# EAGLE schematic M0_Express_eh_shield (EAGLE 9.1.3)
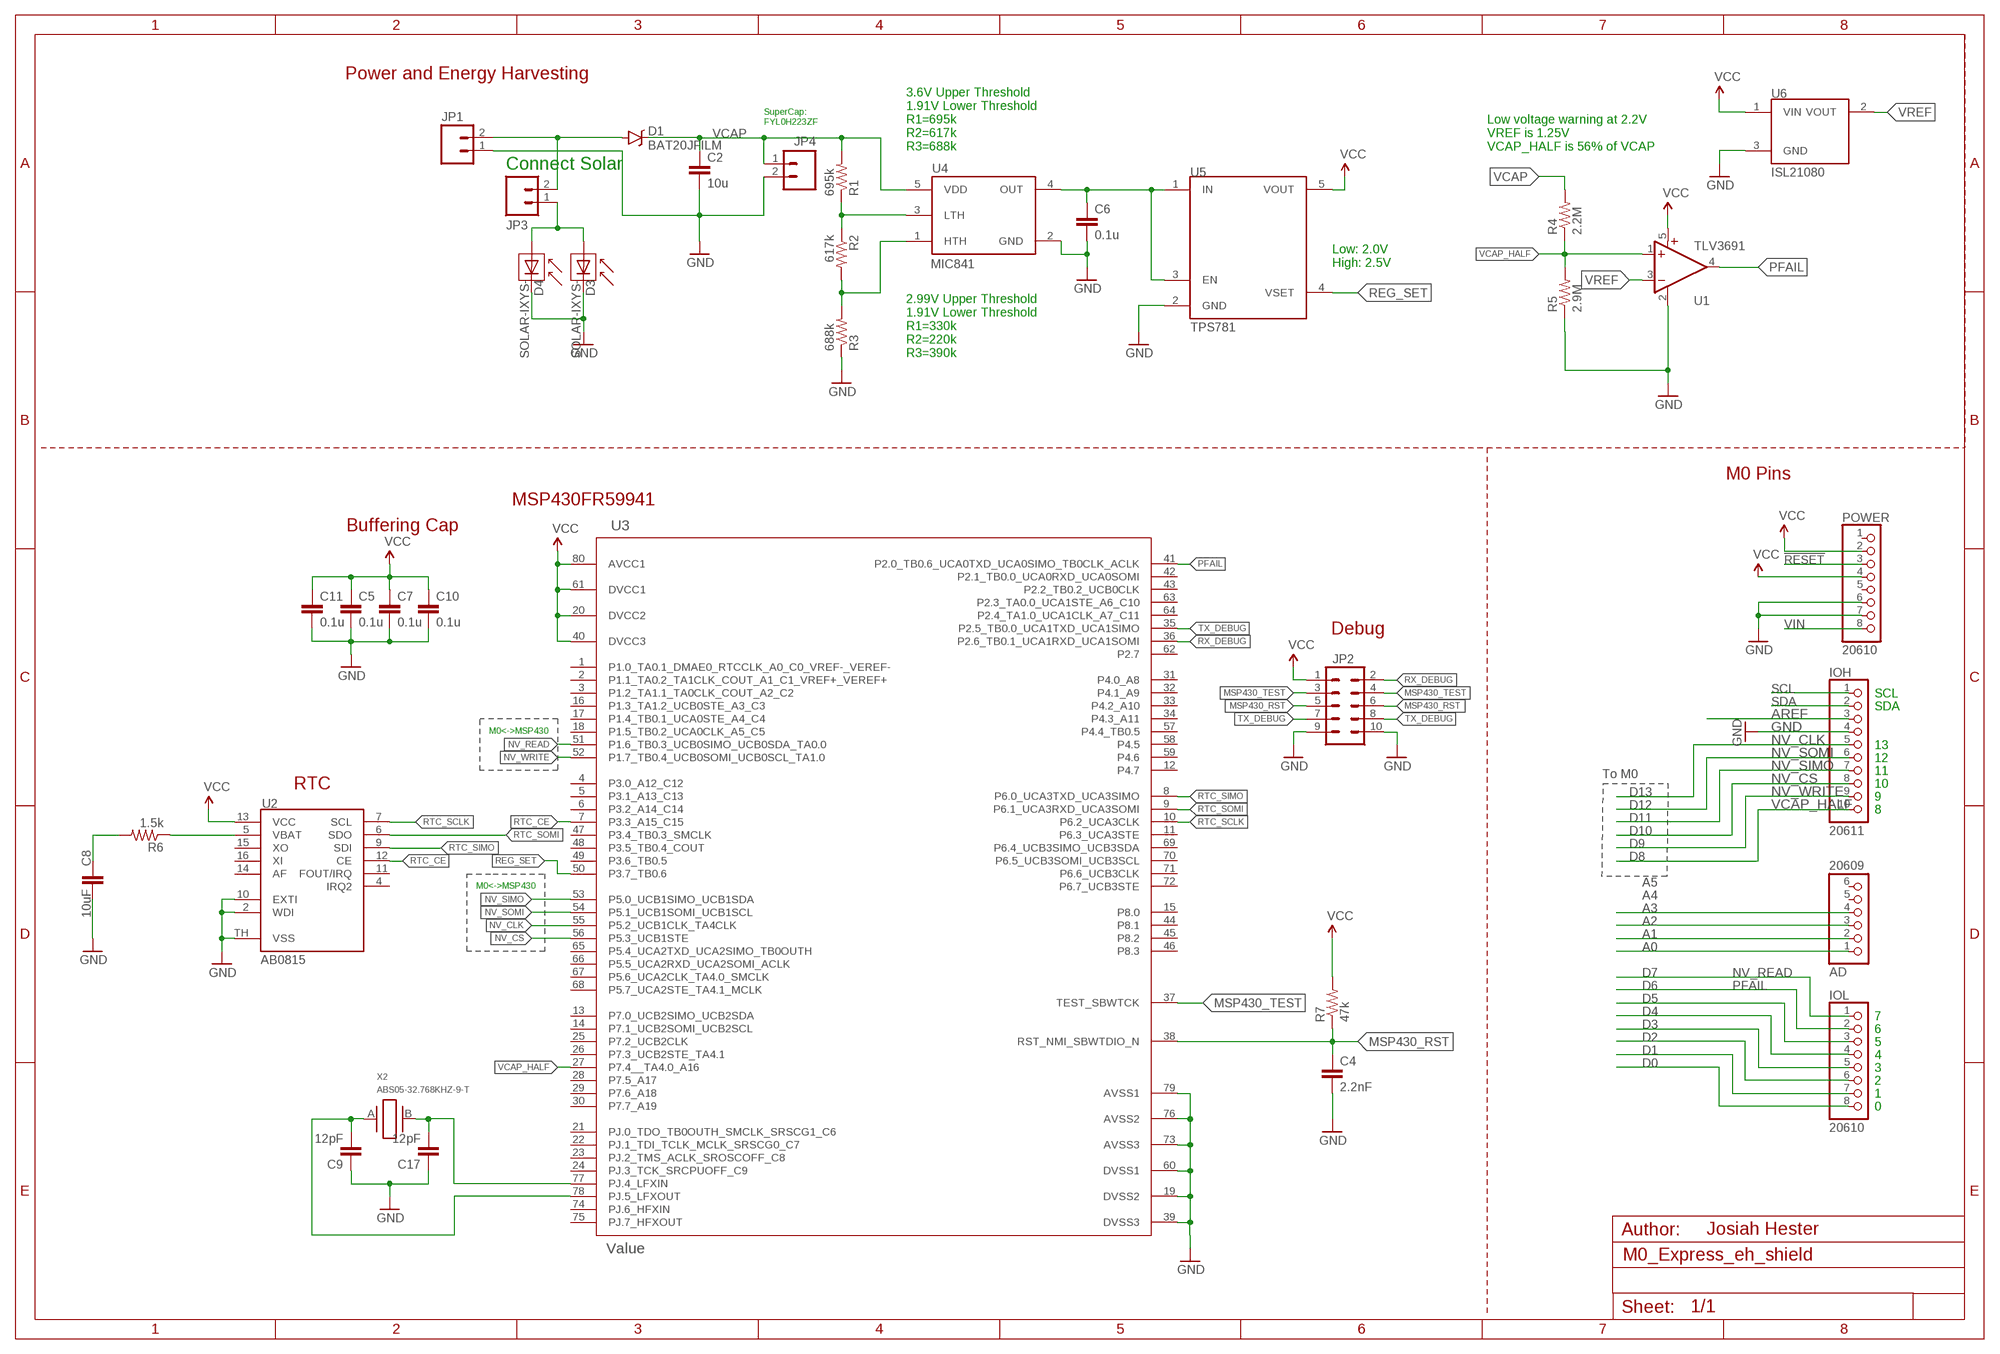
[diagram p0: schematic, sheet 1]

## Parts
AD  20609  HEADER-1X6OVALWAVE  [1X06_OVALWAVE]
C2  10u  CAP0805  [0805]
C4  2.2nF  C-EU0603  [0603]
C5  0.1u  C-EU0603  [0603]
C6  0.1u  C-EU0603  [0603]
C7  0.1u  C-EU0603  [0603]
C8  10uF  CAP0805  [0805]
C9  12pF  C-EU0603  [0603]
C10  0.1u  C-EU0603  [0603]
C11  0.1u  C-EU0603  [0603]
C17  12pF  C-EU0603  [0603]
D1  BAT20JFILM  [SOD-323]
D3  SOLAR-IXYS-  [SOLARBIT-12X1]
D4  SOLAR-IXYS-  [SOLARBIT-12X1]
IOH  20611  HEADER-1X10OVALWAVE  [1X10_OVALWAVE]
IOL  20610  HEADER-1X8OVALWAVE  [1X08_OVALWAVE]
JP1  M02LOCK  [1X02_LOCK]
JP2  M05X21.27MM  [2X5_1.27MM]
JP3  M02LOCK  [1X02_LOCK]
JP4  M025MM  [SCREWTERMINAL-5MM-2]
POWER  20610  HEADER-1X8OVALWAVE  [1X08_OVALWAVE]
R1  695k  R-EU0603  [0603]
R2  617k  R-EU0603  [0603]
R3  688k  R-EU0603  [0603]
R4  2.2M  R-EU0603  [0603]
R5  2.9M  R-EU0603  [0603]
R6  1.5k  R-EU0603  [0603]
R7  47k  R-EU0603  [0603]
U1  TLV3691  [SC70-5]
U2  AB0815  [QFN16]
U3  Value  MSP430FR5994IPNR  [PN0080A_N]
U4  MIC841  [SC70-5]
U5  TPS781  [DCK_R-PDSO-G5]
U6  ISL21080  [SOT-23]
X2  ABS05-32.768KHZ-9-T  [ABS05]

## Nets
!RESET: POWER.3
A0: AD.1
A1: AD.2
A2: AD.3
A3: AD.4
AREF [aref]: IOH.3
D0: IOL.8
D1: IOL.7
D2: IOL.6
D3: IOL.5
D4: IOL.4
D5: IOL.3
GND [gnd]: C2.2 C4.2 C5.2 C6.2 C7.2 C8.2 C9.1 C10.2 C11.2 C17.1 D3.-(C) D4.-(C) IOH.4 JP1.1 JP2.9 JP2.10 JP4.2 POWER.6 POWER.7 R3.1 R5.1 U1.2(GND) U2.2(WDI) U2.10(EXTI) U2.TH(VSS) U3.19(DVSS2) U3.39(DVSS3) U3.60(DVSS1) U3.73(AVSS3) U3.76(AVSS2) U3.79(AVSS1) U4.2(GND) U5.2(GND) U6.3(GND)
MSP430_RST: C4.1 JP2.5 JP2.6 R7.1 U3.38(RST_NMI_SBWTDIO_N)
MSP430_TEST: JP2.3 JP2.4 U3.37(TEST_SBWTCK)
N$1: D1.A JP1.2 JP3.2
N$2: R1.1 R2.1 U4.3(LTH)
N$3: R2.2 R3.2 U4.1(HTH)
N$4: R6.1 U2.5(VBAT)
N$5: C17.2 U3.77(PJ.4_LFXIN) X2.B
N$6: C9.2 U3.78(PJ.5_LFXOUT) X2.A
N$7: C6.1 U4.4(OUT) U5.1(IN) U5.3(EN)
N$8: C8.1 R6.2
N$10: D3.+(A) D4.+(A) JP3.1
NV_CLK: IOH.5 U3.55(P5.2_UCB1CLK_TA4CLK)
NV_CS: IOH.8 U3.56(P5.3_UCB1STE)
NV_READ: IOL.1 U3.51(P1.6_TB0.3_UCB0SIMO_UCB0SDA_TA0.0)
NV_SIMO: IOH.7 U3.53(P5.0_UCB1SIMO_UCB1SDA)
NV_SOMI: IOH.6 U3.54(P5.1_UCB1SOMI_UCB1SCL)
NV_WRITE: IOH.9 U3.52(P1.7_TB0.4_UCB0SOMI_UCB0SCL_TA1.0)
PFAIL: IOL.2 U1.4(OUT) U3.41(P2.0_TB0.6_UCA0TXD_UCA0SIMO_TB0CLK_ACLK)
REG_SET: U3.50(P3.7_TB0.6) U5.4(VSET)
RTC_CE: U2.12(CE) U3.7(P3.3_A15_C15)
RTC_SCLK: U2.7(SCL) U3.10(P6.2_UCA3CLK)
RTC_SIMO: U2.9(SDI) U3.8(P6.0_UCA3TXD_UCA3SIMO)
RTC_SOMI: U2.6(SDO) U3.9(P6.1_UCA3RXD_UCA3SOMI)
RX_DEBUG: JP2.2 U3.36(P2.6_TB0.1_UCA1RXD_UCA1SOMI)
SCL: IOH.1
SDA: IOH.2
TX_DEBUG: JP2.7 JP2.8 U3.35(P2.5_TB0.0_UCA1TXD_UCA1SIMO)
VCAP: C2.1 D1.C JP4.1 R1.2 R4.2 U4.5(VDD)
VCAP_HALF: IOH.10 R4.1 R5.2 U1.1(+IN) U3.27(P7.4__TA4.0_A16)
VCC: C5.1 C7.1 C10.1 C11.1 JP2.1 POWER.2 POWER.4 R7.2 U1.5(V+) U2.13(VCC) U3.20(DVCC2) U3.40(DVCC3) U3.61(DVCC1) U3.80(AVCC1) U5.5(VOUT) U6.1(VIN)
VIN [USB]: POWER.8
VREF: U1.3(-IN) U6.2(VOUT)
Unconnected: AD.5 AD.6 POWER.1 POWER.5 U2.4(IRQ2) U2.11(FOUT/IRQ) U2.14(AF) U2.15(XO) U2.16(XI) U3.1(P1.0_TA0.1_DMAE0_RTCCLK_A0_C0_VREF-_VEREF-) U3.2(P1.1_TA0.2_TA1CLK_COUT_A1_C1_VREF+_VEREF+) U3.3(P1.2_TA1.1_TA0CLK_COUT_A2_C2) U3.4(P3.0_A12_C12) U3.5(P3.1_A13_C13) U3.6(P3.2_A14_C14) U3.11(P6.3_UCA3STE) U3.12(P4.7) U3.13(P7.0_UCB2SIMO_UCB2SDA) U3.14(P7.1_UCB2SOMI_UCB2SCL) U3.15(P8.0) U3.16(P1.3_TA1.2_UCB0STE_A3_C3) U3.17(P1.4_TB0.1_UCA0STE_A4_C4) U3.18(P1.5_TB0.2_UCA0CLK_A5_C5) U3.21(PJ.0_TDO_TB0OUTH_SMCLK_SRSCG1_C6) U3.22(PJ.1_TDI_TCLK_MCLK_SRSCG0_C7) U3.23(PJ.2_TMS_ACLK_SROSCOFF_C8) U3.24(PJ.3_TCK_SRCPUOFF_C9) U3.25(P7.2_UCB2CLK) U3.26(P7.3_UCB2STE_TA4.1) U3.28(P7.5_A17) U3.29(P7.6_A18) U3.30(P7.7_A19) U3.31(P4.0_A8) U3.32(P4.1_A9) U3.33(P4.2_A10) U3.34(P4.3_A11) U3.42(P2.1_TB0.0_UCA0RXD_UCA0SOMI) U3.43(P2.2_TB0.2_UCB0CLK) U3.44(P8.1) U3.45(P8.2) U3.46(P8.3) U3.47(P3.4_TB0.3_SMCLK) U3.48(P3.5_TB0.4_COUT) U3.49(P3.6_TB0.5) U3.57(P4.4_TB0.5) U3.58(P4.5) U3.59(P4.6) U3.62(P2.7) U3.63(P2.3_TA0.0_UCA1STE_A6_C10) U3.64(P2.4_TA1.0_UCA1CLK_A7_C11) U3.65(P5.4_UCA2TXD_UCA2SIMO_TB0OUTH) U3.66(P5.5_UCA2RXD_UCA2SOMI_ACLK) U3.67(P5.6_UCA2CLK_TA4.0_SMCLK) U3.68(P5.7_UCA2STE_TA4.1_MCLK) U3.69(P6.4_UCB3SIMO_UCB3SDA) U3.70(P6.5_UCB3SOMI_UCB3SCL) U3.71(P6.6_UCB3CLK) U3.72(P6.7_UCB3STE) U3.74(PJ.6_HFXIN) U3.75(PJ.7_HFXOUT)

## Notes on the sheet
- Power and Energy Harvesting
- SuperCap:
  FYL0H223ZF
- 3.6V Upper Threshold
  1.91V Lower Threshold
  R1=695k
  R2=617k
  R3=688k
- Low voltage warning at 2.2V
  VREF is 1.25V
  VCAP_HALF is 56% of VCAP
- Connect Solar
- Low: 2.0V
  High: 2.5V
- 2.99V Upper Threshold
  1.91V Lower Threshold
  R1=330k
  R2=220k
  R3=390k
- M0 Pins
- MSP430FR59941
- Buffering Cap
- Debug
- SCL
- SDA
- M0<->MSP430
- 13
- 12
- 11
- To M0
- RTC | 10
- D13 | 9
- D12 | 8
- D11
- D10
- D9
- D8
- A5
- M0<->MSP430
- A4
- D7
- D6
- 7
- 6
- 5
- 4
- 3
- 2
- 1
- 0
- Josiah Hester

## Library data of the parts
AD = microbuilder:HEADER-1X6: PIN HEADER
C2 = SparkFun-Capacitors:CAP: Capacitor Standard 0603 ceramic capacitor, and 0.1" leaded capacitor.
C4-C7 C10 C11 = tiny_passives:C-EU; MPN: 06035C222KAT2A
C8 = SparkFun-Capacitors:CAP: Capacitor Standard 0603 ceramic capacitor, and 0.1" leaded capacitor.; MPN: 0805YD106KAT2A
C9 C17 = tiny_passives:C-EU; MPN: CL10C120JB8NNNC
D1 = SparkFun-DiscreteSemi:BAT20JFILM: 23V, 1A Schottky diode, SOD-323 package; PROD_ID: DIO-11623
D3 D4 = SparkFun-Sensors:SOLAR-IXYS; DIGIKEY: KXOB25-02X8F-ND
IOH = microbuilder:HEADER-1X10: PIN HEADER
IOL POWER = microbuilder:HEADER-1X8: PIN HEADER
JP1 JP3 = SparkFun-Connectors:M02: Standard 2-pin 0.1" header. Use with - straight break away headers ( PRT-00116) - right angle break away headers (PRT-00553) - swiss pins (PRT-00743) - machine pins (PRT-00117) - female headers (PRT-00115) Molex polarized connector foot print use with: PRT-08233 with associated crimp pins and housings. 2.54_SCREWTERM for use with PRT-10571. 3.5mm Screw Terminal footprints for PRT-08084 5mm Screw Terminal footprints for use with PRT-08432
JP2 = SparkFun-Connectors:M05X2: Header 5x2 Standard 10-pin dual row 0.1" header. Commonly used with AVR-ISP. Use with Spark Fun Electronics SKU: PRT-00778; DIGIKEY: 1175-1627-ND
JP4 = SparkFun-Connectors:M02: Standard 2-pin 0.1" header. Use with - straight break away headers ( PRT-00116) - right angle break away headers (PRT-00553) - swiss pins (PRT-00743) - machine pins (PRT-00117) - female headers (PRT-00115) Molex polarized connector foot print use with: PRT-08233 with associated crimp pins and housings. 2.54_SCREWTERM for use with PRT-10571. 3.5mm Screw Terminal footprints for PRT-08084 5mm Screw Terminal footprints for use with PRT-08432; STOREFRONT_ID: PRT-08432
R1 = tiny_passives:R-EU; DIGIKEY: 311-316KHRCT-ND; MANUFACTURERPARTNUMBER: RC0603FR-07316KL; MPN: RC0603FR-07316KL
R2 = tiny_passives:R-EU; DIGIKEY: 311-191KHRCT-ND; MANUFACTURERPARTNUMBER: RC0603FR-07191KL; MPN: RC0603FR-07191KL
R3 = tiny_passives:R-EU; DIGIKEY: 311-499KHRCT-ND; MANUFACTURERPARTNUMBER: RC0603FR-07499KL; MPN: RC0603FR-07499KL
R4 R5 = tiny_passives:R-EU
R6 R7 = tiny_passives:R-EU; MPN: CRCW060347K0JNEA
U1 = tlv3691:TLV3691: 0.9-V to 6.5-V, Nanopower Comparator Datasheets Analog Signal Chain Guide <http://www.ti.com/lit/pdf/slyb174> TLV3691 <http://www.ti.com/lit/ds/symlink/tlv3691.pdf> Manufacturer Product Page TLV3691IDPFR Specifications <http://www.ti.com/general/docs/suppproductinfo.tsp?distId=10&orderablePartNumber=TLV3691IDPFR> Standard Package <javascript:dlgHelp('Standard%20Packaging%20Help');> 1 Category Integrated Circuits (ICs) </product-search/en/integrated-circuits-ics> Family Linear - Comparators </product-search/en/integrated-circuits-ics/linear-comparators/2556221> Series - Packaging <javascript:dlgHelp('Standard%20Packaging%20Help');> Cut Tape (CT) <javascript:dlgHelp('Cut%20Tape%20Help');> Type General Purpose Number of Elements 1 Output Type Push-Pull Voltage - Supply, Single/Dual (±) 0.9 V ~ 6.5 V, ±0.45 V ~ 3.25 V Voltage - Input Offset (Max) 3mV Current - Input Bias (Max) 100pA Current - Output (Typ) 42mA Current - Quiescent (Max) 150nA CMRR, PSRR (Typ) - Propagation Delay (Max) 35µs Hysteresis - Operating Temperature -40°C ~ 125°C Package / Case 6-XFDFN Mounting Type Surface Mount Supplier Device Package 6-X2SON (1x1) Online Catalog Comparators - 1 element </catalog/en/partgroup/comparators-1-element/3112?mpart=TLV3691IDPFR&vendor=296&WT.z_ref_page_type=PS&WT.z_ref_page_sub_type=PD&WT.z_ref_page_id=PD&WT.z_ref_page_event=DC_Link_Table> Other Names 296-37242-1
U2 = AB08XX:AB0815: AB08X5 Real-Time Clock Family: SPI The ABRACON AB08X5 Real-Time Clock family provides a groundbreaking combination of ultra-low power coupled with a highly sophisticated feature set. With power requirements significantly lower than any other industry RTC (as low as 14 nA), these are the first semiconductors based on innovative SPOTTM (Subthreshold Power Optimized Technology) CMOS platform. The AB08X5 includes on-chip oscillators to provide minimum power consumption, full RTC functions including battery backup and programmable counters and alarms for timer and watchdog functions, and either an I2C or SPI serial interface for communication with a host controller.; DIGIKEY: 535-11930-1-ND; MPN: AB0815-T3
U3 = msp430fr5994:MSP430FR5994IPNR; DIGIKEY: 296-45561-1-ND; MANUFACTURER: Texas Instruments; PARTNUMBER: MSP430FR5994IPNR; REFDES: RefDes; TYPE: TYPE
U4 = fedpower:MIC841: MIC841:Comparator with reference and adj. hysteresis; DIGIKEY: 576-2923-1-ND; MPN: MIC841HYC5-TR
U5 = ti-regulator:TPS781: Texas Instruments: TPS781 150mA, Low-Dropout Regulator, Ultralow-Power, IQ 1µA with Pin-Selectable, Dual-Level Output Voltage; DIGIKEY: 296-29966-1-ND
U6 = isl21080:ISL21080: Intersil: ISL21080, 300nA NanoPower Voltage References The ISL21080 analog voltage references feature low supply voltage operation at ultra-low 310nA typ, 1.5µA max operating current. Additionally, the ISL21080 family features guaranteed initial accuracy as low as ±0.2% and 50ppm/°C temperature coefficient. These references are ideal for general purpose portable applications to extend battery life at lower cost. The ISL21080 is provided in the industry standard 3 Ld SOT-23 pinout. The ISL21080 output voltages can be used as precision voltage sources for voltage monitors, control loops, standby voltages for low power states for DSP, FPGA, Datapath Controllers, microcontrollers and other core voltages: 0.9V, 1.024V, 1.25V, 1.5V, 2.048V, 2.5V, 3.0V, 3.3V, 4.096V and 5.0V. Special Note: Post-assembly x-ray inspection may lead to permanent changes in device output voltage and should be minimized or avoided. For further information, please see “Applications Information” on page 14 and AN1533, “X-Ray Effects on Intersil FGA References”.; DIGIKEY: ISL21080DIH312Z-TKTR-ND
X2 = abs05:ABS05-32.768KHZ: 32.768kHz Crystal; DIGIKEY: 535-11897-1-ND; MPN: ABS05-32.768KHZ-9-T

## Net classes
0 default: width 0.33 mm, drill 0.33 mm, clearance 0.152 mm